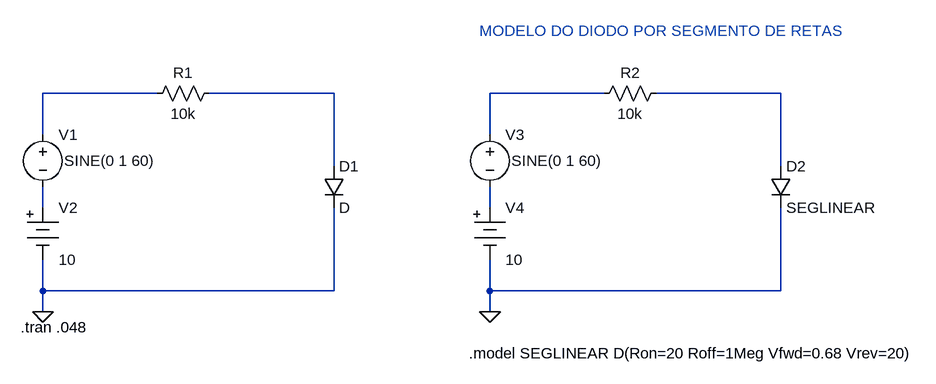
[diagram p0: schematic Diodo - Diodo_Pequenos_Sinais_Exemplo 1.asc]
Diodo - Diodo_Pequenos_Sinais_Exemplo 1.asc, the LTspice schematic file:
Version 4
SHEET 1 1404 680
WIRE 208 112 32 112
WIRE 480 112 288 112
WIRE 896 112 720 112
WIRE 1168 112 976 112
WIRE 32 176 32 112
WIRE 720 176 720 112
WIRE 480 224 480 112
WIRE 1168 224 1168 112
WIRE 32 288 32 256
WIRE 720 288 720 256
WIRE 32 416 32 368
WIRE 480 416 480 288
WIRE 480 416 32 416
WIRE 720 416 720 368
WIRE 1168 416 1168 288
WIRE 1168 416 720 416
WIRE 32 448 32 416
WIRE 720 448 720 416
FLAG 32 448 0
FLAG 720 448 0
SYMBOL voltage 32 160 R0
WINDOW 3 33 56 Left 2
WINDOW 123 0 0 Left 2
WINDOW 39 0 0 Left 2
SYMATTR InstName V1
SYMATTR Value SINE(0 1 60)
SYMBOL Misc\\battery 32 272 R0
SYMATTR InstName V2
SYMATTR Value 10
SYMATTR SpiceLine Rser=0
SYMBOL res 192 128 R270
WINDOW 0 32 56 VTop 2
WINDOW 3 0 56 VBottom 2
SYMATTR InstName R1
SYMATTR Value 10k
SYMBOL diode 464 224 R0
SYMATTR InstName D1
SYMBOL voltage 720 160 R0
WINDOW 3 33 56 Left 2
WINDOW 123 0 0 Left 2
WINDOW 39 0 0 Left 2
SYMATTR InstName V3
SYMATTR Value SINE(0 1 60)
SYMBOL Misc\\battery 720 272 R0
SYMATTR InstName V4
SYMATTR Value 10
SYMATTR SpiceLine Rser=0
SYMBOL res 880 128 R270
WINDOW 0 32 56 VTop 2
WINDOW 3 0 56 VBottom 2
SYMATTR InstName R2
SYMATTR Value 10k
SYMBOL diode 1152 224 R0
SYMATTR InstName D2
SYMATTR Value SEGLINEAR
TEXT -2 472 Left 2 !.tran .048
TEXT 688 512 Left 2 !.model SEGLINEAR D(Ron=20 Roff=1Meg Vfwd=0.68 Vrev=20)
TEXT 704 16 Left 2 ;MODELO DO DIODO POR SEGMENTO DE RETAS

The netlist it stands for:
* Diodo - Diodo_Pequenos_Sinais_Exemplo 1.asc
V1 N001 N005 SINE(0 1 60)
V2 N005 0 10 Rser=0
R1 N001 N002 10k
D1 N002 0 D
V3 N003 N006 SINE(0 1 60)
V4 N006 0 10 Rser=0
R2 N003 N004 10k
D2 N004 0 SEGLINEAR
.model D D
.lib standard.dio
.tran .048
.model SEGLINEAR D(Ron=20 Roff=1Meg Vfwd=0.68 Vrev=20)
* MODELO DO DIODO POR SEGMENTO DE RETAS
.backanno
.end